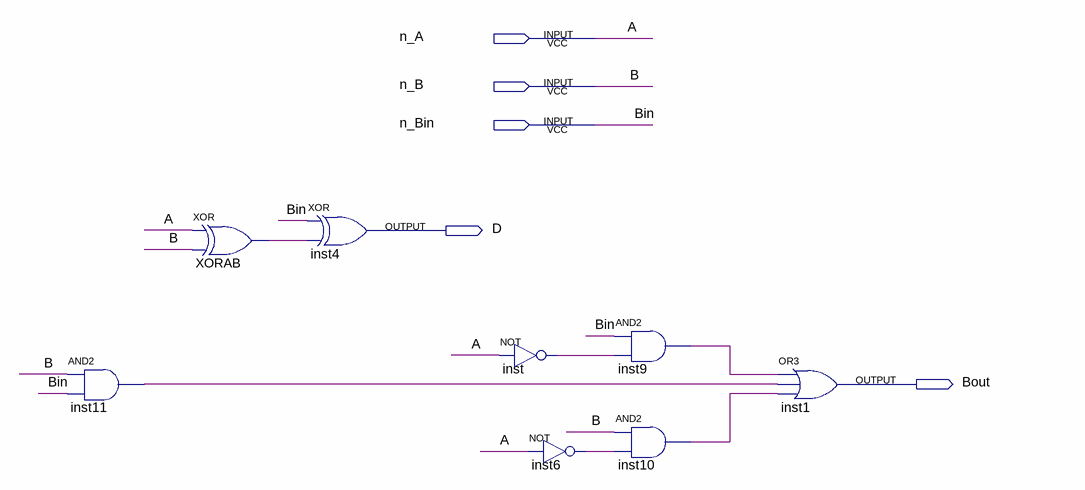
[diagram p0: schematic sheet]
// Quartus schematic subtrator_completo.bdf as structural Verilog: 8 symbols, 5 pins
module subtrator_completo (
  input  n_A,
  input  n_B,
  input  n_Bin,
  output D,
  output Bout
);

  wire inst6_out, inst9_out, inst10_out, inst11_out, inst_out, XORAB_out;

  and inst11 (inst11_out, n_B, n_Bin);
  xor XORAB (XORAB_out, n_A, n_B);
  xor inst4 (D, n_Bin, XORAB_out);
  not inst (inst_out, n_A);
  not inst6 (inst6_out, n_A);
  and inst9 (inst9_out, n_Bin, inst_out);
  and inst10 (inst10_out, n_B, inst6_out);
  or inst1 (Bout, inst9_out, inst11_out, inst10_out);

  // Other names for the same wires on the sheet: A = n_A; B = n_B; Bin = n_Bin
endmodule
